# Altium project STM_System_Board.PrjPCB (part 6 of 6)
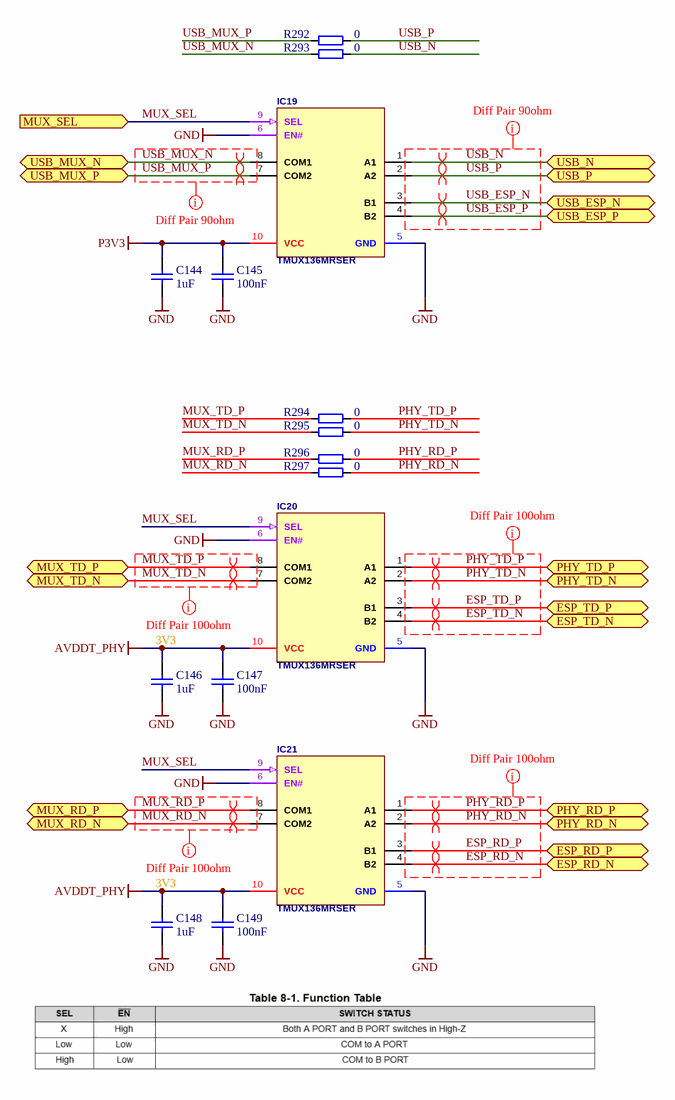
[diagram p14: USB_ETH_Mux.SchDoc]

## Nets that join several sheets
AVDDT_PHY: CPU (J16.35 J16.38 J16.41), Ethernet (12 pins), RMII (7 pins), USB_ETH_Mux (6 pins)
GND: STM_System_Board (20 pins), USB (11 pins), CPU (81 pins), Cpcis_connectors_P4_P5_P6 (80 pins), ST_SYS_Board_FPGA (D13.2 D14.2 IC6.AD4 IC6.AF4), U_LVDS_Driver2 (37 pins), U_LVDS_Driver1 (37 pins), U_LVDS_Driver4 (37 pins), U_LVDS_Driver6 (37 pins), U_LVDS_Driver5 (37 pins), U_LVDS_Driver3 (37 pins), STM_System_Board_Supply (53 pins), ST_SYS_Board_FPGA_SUP (255 pins), DIO_buffer (13 pins), Ethernet (11 pins), ST_SYS_Board_Config (14 pins), ST_SYS_Board_Clocking (11 pins), RMII (14 pins), USB_ETH_Mux (12 pins)
P1V1: STM_System_Board_Supply (11 pins), ST_SYS_Board_FPGA_SUP (45 pins)
P2V5: STM_System_Board_Supply (7 pins), ST_SYS_Board_FPGA_SUP (48 pins), ST_SYS_Board_Clocking (7 pins)
P3V3: STM_System_Board (D12.5 W1.1), CPU (52 pins), ST_SYS_Board_FPGA (D13.5 D14.5 IC6.AE4 R229.2), U_LVDS_Driver2 (35 pins), U_LVDS_Driver1 (35 pins), U_LVDS_Driver4 (35 pins), U_LVDS_Driver6 (35 pins), U_LVDS_Driver5 (35 pins), U_LVDS_Driver3 (35 pins), STM_System_Board_Supply (10 pins), ST_SYS_Board_FPGA_SUP (21 pins), DIO_buffer (9 pins), ST_SYS_Board_Config (13 pins), ST_SYS_Board_Clocking (OSC1.1 OSC1.4), RMII (8 pins), USB_ETH_Mux (C144.2 C145.1 IC19.10)
1_PE_CLK_N: Cpcis_connectors_P4_P5_P6 (J31.B5), ST_SYS_Board_Clocking (IC17.25)
1_PE_CLK_P: Cpcis_connectors_P4_P5_P6 (J31.A5), ST_SYS_Board_Clocking (IC17.24)
1_SERVMOD_N: CPU (IC9.12 J16.12), Cpcis_connectors_P4_P5_P6 (J31.C5)
2_PE_CLK_N: Cpcis_connectors_P4_P5_P6 (J31.E5), ST_SYS_Board_Clocking (IC17.21)
2_PE_CLK_P: Cpcis_connectors_P4_P5_P6 (J31.D5), ST_SYS_Board_Clocking (IC17.20)
2_SERVMOD_N: CPU (IC9.13 J16.13), Cpcis_connectors_P4_P5_P6 (J31.F5)
3_PE_CLK_N: Cpcis_connectors_P4_P5_P6 (J31.H5), ST_SYS_Board_Clocking (IC17.19)
3_PE_CLK_P: Cpcis_connectors_P4_P5_P6 (J31.G5), ST_SYS_Board_Clocking (IC17.18)
3_SERVMOD_N: CPU (IC9.14 J16.15), Cpcis_connectors_P4_P5_P6 (J31.I5)
4_PE_CLK_N: Cpcis_connectors_P4_P5_P6 (J31.K5), ST_SYS_Board_Clocking (IC17.17)
4_PE_CLK_P: Cpcis_connectors_P4_P5_P6 (J31.J5), ST_SYS_Board_Clocking (IC17.16)
4_SERVMOD_N: CPU (IC9.15 J16.16), Cpcis_connectors_P4_P5_P6 (J31.L5)
5_PE_CLK_N: Cpcis_connectors_P4_P5_P6 (J31.C6), ST_SYS_Board_Clocking (IC17.23)
5_PE_CLK_P: Cpcis_connectors_P4_P5_P6 (J31.B6), ST_SYS_Board_Clocking (IC17.22)
5_SERVMOD_N: CPU (IC9.50 J16.18), Cpcis_connectors_P4_P5_P6 (J31.A6)
6_PE_CLK_N: Cpcis_connectors_P4_P5_P6 (J31.F6), ST_SYS_Board_Clocking (IC17.27)
6_PE_CLK_P: Cpcis_connectors_P4_P5_P6 (J31.E6), ST_SYS_Board_Clocking (IC17.26)
6_SERVMOD_N: CPU (IC9.53 J16.19), Cpcis_connectors_P4_P5_P6 (J31.D6)
7_PE_CLK_N: Cpcis_connectors_P4_P5_P6 (J31.I6), ST_SYS_Board_Clocking (IC17.13)
7_PE_CLK_P: Cpcis_connectors_P4_P5_P6 (J31.H6), ST_SYS_Board_Clocking (IC17.12)
7_SERVMOD_N: CPU (IC9.54 J16.21), Cpcis_connectors_P4_P5_P6 (J31.G6)
8_PE_CLK_N: Cpcis_connectors_P4_P5_P6 (J31.L6), ST_SYS_Board_Clocking (IC17.3)
8_PE_CLK_P: Cpcis_connectors_P4_P5_P6 (J31.K6), ST_SYS_Board_Clocking (IC17.2)
8_SERVMOD_N: CPU (IC9.55 J16.22), Cpcis_connectors_P4_P5_P6 (J31.J6)
CFG_FLASH_MISO: CPU (J16.27 R185.1), ST_SYS_Board_Config (IC15.8)
CFG_FLASH_MOSI: CPU (J16.30 R197.1), ST_SYS_Board_Config (IC15.4)
CFG_FLASH_SCLK: CPU (J16.31 R177.1), ST_SYS_Board_Config (IC15.1)
CFG_FLASH_SSEL: CPU (J16.33 R179.1), ST_SYS_Board_Config (IC15.11)
CFG_FLASH_UP_EN: CPU (IC9.68 J16.28), ST_SYS_Board_Config (5 pins)
CFG_TCK: CPU (J17.8), ST_SYS_Board_Config (D11.1 IC6.AD5 J6.6 R239.2)
CFG_TDI: CPU (J17.11), ST_SYS_Board_Config (D11.4 IC6.AC5 J6.10 R241.1)
CFG_TDO: CPU (J17.10), ST_SYS_Board_Config (D11.6 IC6.AB5 J6.8 R227.1)
CFG_TMS: CPU (J17.7), ST_SYS_Board_Config (D11.3 IC6.AE5 J6.4 R240.2)
CLK_FPGA: ST_SYS_Board_FPGA (IC6.A24), ST_SYS_Board_Clocking (R205.2)
CLK_IN_SEL: CPU (IC9.132 J17.5), ST_SYS_Board_Clocking (R243.1)
CLK_STM: CPU (R176.1), ST_SYS_Board_FPGA (IC6.A2)
CPU_RESETn: CPU (R14.2 T4.3), STM_System_Board_Supply (IC13.26 R194.1 T1.1 TP8.1)
CS: STM_System_Board (P1.2), ST_SYS_Board_FPGA (D13.3 IC6.A23), U_LVDS_Driver2 (IC8B.12), U_LVDS_Driver1 (IC8A.12), U_LVDS_Driver4 (IC8D.12), U_LVDS_Driver6 (IC8F.12), U_LVDS_Driver5 (IC8E.12), U_LVDS_Driver3 (IC8C.12)
DIO_OEn0: ST_SYS_Board_FPGA (IC6.AC26), DIO_buffer (IC2.1 IC3.1 R11.2)
DIO_OEn1: ST_SYS_Board_FPGA (IC6.AB26), DIO_buffer (IC2.4 IC3.4 R18.2)
DIO_OEn2: ST_SYS_Board_FPGA (IC6.AB25), DIO_buffer (IC2.10 IC3.10 R21.2)
DIO_OEn3: ST_SYS_Board_FPGA (IC6.AA26), DIO_buffer (IC2.13 IC3.13 R59.2)
DONE: CPU (IC9.142 J16.24 R136.2), ST_SYS_Board_FPGA (IC6.AC4)
ESP_RD_N: CPU (J16.39), USB_ETH_Mux (IC21.4)
ESP_RD_P: CPU (J16.40), USB_ETH_Mux (IC21.3)
ESP_TD_N: CPU (J16.37), USB_ETH_Mux (IC20.4)
ESP_TD_P: CPU (J16.36), USB_ETH_Mux (IC20.3)
ETH_PHY_NRST: CPU (IC9.2), RMII (IC11.15 R198.2)
FP_LED_0: STM_System_Board (R58.2), CPU (IC9.37 J16.6)
FP_LED_1: STM_System_Board (R76.2), CPU (IC9.96 J16.7)
FP_LED_2: STM_System_Board (R77.2), CPU (IC9.97 J16.9)
FP_LED_3: STM_System_Board (R78.2), CPU (IC9.34 J16.10)
FSEN: STM_System_Board (P1.1), ST_SYS_Board_FPGA (D13.1 IC6.B19), U_LVDS_Driver2 (8 pins), U_LVDS_Driver1 (8 pins), U_LVDS_Driver4 (8 pins), U_LVDS_Driver6 (8 pins), U_LVDS_Driver5 (8 pins), U_LVDS_Driver3 (8 pins)
I2C1_SCL: CPU (5 pins), STM_System_Board_Supply (IC18.3)
I2C1_SDA: CPU (5 pins), STM_System_Board_Supply (IC18.4)
IO0: ST_SYS_Board_FPGA (IC6.AE26), DIO_buffer (R17.2)
IO1: ST_SYS_Board_FPGA (IC6.AE25), DIO_buffer (R5.2)
IO2: ST_SYS_Board_FPGA (IC6.AD25), DIO_buffer (R6.2)
IO3: ST_SYS_Board_FPGA (IC6.AD26), DIO_buffer (R7.2)
LED1: Ethernet (R39.1), RMII (IC11.2 R55.1)
LED2: Ethernet (R212.1), RMII (IC11.3)
MISO: STM_System_Board (P1.5), ST_SYS_Board_FPGA (D14.6 IC6.AD3), U_LVDS_Driver6 (IC8F.9)
MISO: U_LVDS_Driver2 (IC8B.14), U_LVDS_Driver1 (IC8A.9)
MISO: U_LVDS_Driver2 (IC8B.9), U_LVDS_Driver3 (IC8C.14)
MISO: U_LVDS_Driver4 (IC8D.14), U_LVDS_Driver3 (IC8C.9)
MISO: U_LVDS_Driver4 (IC8D.9), U_LVDS_Driver5 (IC8E.14)
MISO: U_LVDS_Driver6 (IC8F.14), U_LVDS_Driver5 (IC8E.9)
MLVDS_RxTx1_8: ST_SYS_Board_FPGA (IC6.E21), U_LVDS_Driver1 (R167A.1)
MLVDS_RxTx1_9: ST_SYS_Board_FPGA (IC6.D22), U_LVDS_Driver1 (R169A.1)
MLVDS_RxTx1_10: ST_SYS_Board_FPGA (IC6.C22), U_LVDS_Driver1 (R171A.1)
MLVDS_RxTx1_11: ST_SYS_Board_FPGA (IC6.C17), U_LVDS_Driver1 (R173A.1)
MLVDS_RxTx1_12: ST_SYS_Board_FPGA (IC6.B23), U_LVDS_Driver1 (R175A.1)
MLVDS_RxTx1_13: ST_SYS_Board_FPGA (IC6.C21), U_LVDS_Driver1 (R184A.1)
MLVDS_RxTx1_14: ST_SYS_Board_FPGA (IC6.C19), U_LVDS_Driver1 (R191A.1)
MLVDS_RxTx1_15: ST_SYS_Board_FPGA (IC6.C18), U_LVDS_Driver1 (R193A.1)
MLVDS_RxTx2_8: ST_SYS_Board_FPGA (IC6.A22), U_LVDS_Driver2 (R167B.1)
MLVDS_RxTx2_9: ST_SYS_Board_FPGA (IC6.A21), U_LVDS_Driver2 (R169B.1)
MLVDS_RxTx3_8: ST_SYS_Board_FPGA (IC6.D17), U_LVDS_Driver3 (R167C.1)
MLVDS_RxTx3_9: ST_SYS_Board_FPGA (IC6.A19), U_LVDS_Driver3 (R169C.1)
MLVDS_RxTx4_8: ST_SYS_Board_FPGA (IC6.A17), U_LVDS_Driver4 (R167D.1)
MLVDS_RxTx4_9: ST_SYS_Board_FPGA (IC6.B16), U_LVDS_Driver4 (R169D.1)
MLVDS_RxTx5_8: ST_SYS_Board_FPGA (IC6.A13), U_LVDS_Driver5 (R167E.1)
MLVDS_RxTx5_9: ST_SYS_Board_FPGA (IC6.D14), U_LVDS_Driver5 (R169E.1)
MLVDS_RxTx6_8: ST_SYS_Board_FPGA (IC6.C10), U_LVDS_Driver6 (R167F.1)
MLVDS_RxTx6_9: ST_SYS_Board_FPGA (IC6.A9), U_LVDS_Driver6 (R169F.1)
MLVDS_RxTx10: ST_SYS_Board_FPGA (IC6.A16), U_LVDS_Driver4 (R171D.1)
MLVDS_RxTx10: ST_SYS_Board_FPGA (IC6.A18), U_LVDS_Driver3 (R171C.1)
MLVDS_RxTx10: ST_SYS_Board_FPGA (IC6.D19), U_LVDS_Driver2 (R171B.1)
MLVDS_RxTx10: ST_SYS_Board_FPGA (IC6.A8), U_LVDS_Driver6 (R171F.1)
MLVDS_RxTx10: ST_SYS_Board_FPGA (IC6.A11), U_LVDS_Driver5 (R171E.1)
MLVDS_RxTx11: ST_SYS_Board_FPGA (IC6.B17), U_LVDS_Driver3 (R173C.1)
MLVDS_RxTx11: ST_SYS_Board_FPGA (IC6.B21), U_LVDS_Driver2 (R173B.1)
MLVDS_RxTx11: ST_SYS_Board_FPGA (IC6.C14), U_LVDS_Driver4 (R173D.1)
MLVDS_RxTx11: ST_SYS_Board_FPGA (IC6.B10), U_LVDS_Driver5 (R173E.1)
MLVDS_RxTx11: ST_SYS_Board_FPGA (IC6.C6), U_LVDS_Driver6 (R173F.1)
MLVDS_RxTx12: ST_SYS_Board_FPGA (IC6.C16), U_LVDS_Driver2 (R175B.1)
MLVDS_RxTx12: ST_SYS_Board_FPGA (IC6.B8), U_LVDS_Driver6 (R175F.1)
MLVDS_RxTx12: ST_SYS_Board_FPGA (IC6.C8), U_LVDS_Driver4 (R175D.1)
MLVDS_RxTx12: ST_SYS_Board_FPGA (IC6.D10), U_LVDS_Driver3 (R175C.1)
MLVDS_RxTx12: ST_SYS_Board_FPGA (IC6.E6), U_LVDS_Driver5 (R175E.1)
MLVDS_RxTx13: ST_SYS_Board_FPGA (IC6.A15), U_LVDS_Driver2 (R184B.1)
MLVDS_RxTx13: ST_SYS_Board_FPGA (IC6.A5), U_LVDS_Driver4 (R184D.1)
MLVDS_RxTx13: ST_SYS_Board_FPGA (IC6.A6), U_LVDS_Driver6 (R184F.1)
MLVDS_RxTx13: ST_SYS_Board_FPGA (IC6.C11), U_LVDS_Driver3 (R184C.1)
MLVDS_RxTx13: ST_SYS_Board_FPGA (IC6.D5), U_LVDS_Driver5 (R184E.1)
MLVDS_RxTx14: ST_SYS_Board_FPGA (IC6.A14), U_LVDS_Driver2 (R191B.1)
MLVDS_RxTx14: ST_SYS_Board_FPGA (IC6.B13), U_LVDS_Driver5 (R191E.1)
MLVDS_RxTx14: ST_SYS_Board_FPGA (IC6.A4), U_LVDS_Driver6 (R191F.1)
MLVDS_RxTx14: ST_SYS_Board_FPGA (IC6.B6), U_LVDS_Driver3 (R191C.1)
MLVDS_RxTx14: ST_SYS_Board_FPGA (IC6.C5), U_LVDS_Driver4 (R191D.1)
MLVDS_RxTx15: ST_SYS_Board_FPGA (IC6.B14), U_LVDS_Driver2 (R193B.1)
MLVDS_RxTx15: ST_SYS_Board_FPGA (IC6.A10), U_LVDS_Driver5 (R193E.1)
MLVDS_RxTx15: ST_SYS_Board_FPGA (IC6.B4), U_LVDS_Driver6 (R193F.1)
MLVDS_RxTx15: ST_SYS_Board_FPGA (IC6.C9), U_LVDS_Driver3 (R193C.1)
MLVDS_RxTx15: ST_SYS_Board_FPGA (IC6.D6), U_LVDS_Driver4 (R193D.1)
MOSI: STM_System_Board (P1.4), ST_SYS_Board_FPGA (D14.4 IC6.AB3), U_LVDS_Driver1 (IC8A.14)
MUX_RD_N: Ethernet (D3.1 R40.2 R222.1), USB_ETH_Mux (IC21.7 R297.1)
MUX_RD_P: Ethernet (D3.3 R41.2 R221.1), USB_ETH_Mux (IC21.8 R296.1)
MUX_SEL: CPU (J16.1 R291.2 T4.1), USB_ETH_Mux (IC19.9 IC20.9 IC21.9)
MUX_TD_N: Ethernet (D3.4 R37.1 R220.1), USB_ETH_Mux (IC20.7 R295.1)
MUX_TD_P: Ethernet (D3.6 R36.1 R199.1), USB_ETH_Mux (IC20.8 R294.1)
NetC129_1: STM_System_Board (J10.1), ST_SYS_Board_Clocking (C129.1 D16.6)
NetD10_1: STM_System_Board (J1.1), DIO_buffer (D10.1 R15.1 R19.2 R20.1)
NetD10_3: STM_System_Board (J2.1), DIO_buffer (D10.3 R8.1 R9.2 R10.1)
NetD10_4: STM_System_Board (J4.1), DIO_buffer (D10.4 R92.1 R93.2 R200.1)
NetD10_6: STM_System_Board (J5.1), DIO_buffer (D10.6 R201.1 R202.2 R203.1)
NetIC9_27: CPU (IC9.27), RMII (IC11.13)
NetIC9_35: CPU (IC9.35), RMII (R60.1)
NetIC9_36: CPU (IC9.36), RMII (IC11.12 R98.2)
NetIC9_43: CPU (IC9.43), RMII (R50.1)
NetIC9_44: CPU (IC9.44), RMII (R45.1)
NetIC9_45: CPU (IC9.45), RMII (R46.1)
NetIC9_70: CPU (IC9.70), RMII (IC11.16)
NetIC9_74: CPU (IC9.74), RMII (IC11.18)
NetIC9_128: CPU (IC9.128), RMII (IC11.17)
PHY_RD_N: RMII (IC11.22), USB_ETH_Mux (IC21.2 R297.2)
PHY_RD_P: RMII (IC11.23), USB_ETH_Mux (IC21.1 R296.2)
PHY_TD_N: RMII (IC11.20), USB_ETH_Mux (IC20.2 R295.2)
PHY_TD_P: RMII (IC11.21), USB_ETH_Mux (IC20.1 R294.2)
PROGRAM_N: CPU (IC9.141 J16.25), ST_SYS_Board_FPGA (IC6.AB4)
QSPI_CFG_CEN: ST_SYS_Board_FPGA (IC6.AA2), ST_SYS_Board_Config (IC14.1 IC15.10 R223.1)
QSPI_CFG_IO2: ST_SYS_Board_FPGA (IC6.AF2), ST_SYS_Board_Config (IC14.3 R225.1)
QSPI_CFG_IO3: ST_SYS_Board_FPGA (IC6.AE1), ST_SYS_Board_Config (IC14.7 R224.1)
QSPI_CFG_MISO_IO1: ST_SYS_Board_FPGA (IC6.AD2), ST_SYS_Board_Config (IC14.2 IC15.9)
QSPI_CFG_MOSI_IO0: ST_SYS_Board_FPGA (IC6.AE2), ST_SYS_Board_Config (IC14.5 IC15.3)
QSPI_CFG_SCK: ST_SYS_Board_FPGA (IC6.AE3), ST_SYS_Board_Config (IC14.6 IC15.2 R226.1)
QSPI_CLK: CPU (R128.1), ST_SYS_Board_FPGA (IC6.E11)
QSPI_IO0: CPU (R186.2), ST_SYS_Board_FPGA (IC6.AB24)
QSPI_IO1: CPU (R187.2), ST_SYS_Board_FPGA (IC6.AA24)
QSPI_IO2: CPU (R188.2), ST_SYS_Board_FPGA (IC6.AA23)
QSPI_IO3: CPU (R189.2), ST_SYS_Board_FPGA (IC6.AA22)
QSPI_NCS: CPU (IC9.112), ST_SYS_Board_FPGA (IC6.AF25)
SCK: STM_System_Board (P1.3), ST_SYS_Board_FPGA (D13.4 IC6.A25), U_LVDS_Driver2 (IC8B.11), U_LVDS_Driver1 (IC8A.11), U_LVDS_Driver4 (IC8D.11), U_LVDS_Driver6 (IC8F.11), U_LVDS_Driver5 (IC8E.11), U_LVDS_Driver3 (IC8C.11)
SPI1_MISO: CPU (IC9.124 J17.14 R185.2), ST_SYS_Board_FPGA (IC6.E16)
SPI1_MOSI: CPU (IC9.123 J17.13 R197.2), ST_SYS_Board_FPGA (IC6.E19)
SPI1_NSS: CPU (IC9.125 J17.16 R179.2), ST_SYS_Board_FPGA (IC6.D21)
SPI1_SCK: CPU (IC9.126 J17.17 R177.2), ST_SYS_Board_FPGA (IC6.C13)
SPI2_MISO: CPU (IC9.28 J17.20), ST_SYS_Board_FPGA (IC6.AC1)
SPI2_MOSI: CPU (IC9.29 J17.19), ST_SYS_Board_FPGA (IC6.AB2)
SPI2_NSS: CPU (IC9.73 J17.22), ST_SYS_Board_FPGA (IC6.D9)
SPI2_SCK: CPU (IC9.117 J17.23), ST_SYS_Board_FPGA (IC6.D13)
SPI3_MISO: CPU (IC9.134 J17.26), ST_SYS_Board_FPGA (IC6.D16)
SPI3_MOSI: CPU (IC9.48 J17.25), ST_SYS_Board_FPGA (IC6.AA1)
SPI3_NSS: CPU (IC9.40 J17.28), ST_SYS_Board_FPGA (IC6.AB1)
SPI3_SCK: CPU (IC9.111 J17.29), ST_SYS_Board_FPGA (IC6.E13)
SPI4_CLK: CPU (IC9.1 J17.35), ST_SYS_Board_FPGA (IC6.B11)
SPI4_MISO: CPU (IC9.4 J17.32), ST_SYS_Board_FPGA (IC6.D11)
SPI4_MOSI: CPU (IC9.5 J17.31), ST_SYS_Board_FPGA (IC6.E10)
SPI4_NSS: CPU (IC9.3 J17.34), ST_SYS_Board_FPGA (IC6.E8)
SPI5_MISO: CPU (IC9.20 J17.38), ST_SYS_Board_FPGA (IC6.AD1)
SPI5_MOSI: CPU (IC9.21 J17.37), ST_SYS_Board_FPGA (IC6.AC2)
SPI5_NSS: CPU (IC9.18 J17.40), ST_SYS_Board_FPGA (IC6.D8)
SPI5_SCK: CPU (IC9.19 J17.41), ST_SYS_Board_FPGA (IC6.A3)
SPI6_MISO: CPU (IC9.127 J17.44), ST_SYS_Board_FPGA (IC6.D18)
SPI6_MOSI: CPU (IC9.129 J17.43), ST_SYS_Board_FPGA (IC6.E17)
SPI6_NSS: CPU (IC9.93 J17.46), ST_SYS_Board_FPGA (IC6.E14)
SPI6_SCK: CPU (IC9.41 J17.47), ST_SYS_Board_FPGA (IC6.A12)
USART3_RX: STM_System_Board (D12.6 W1.2), CPU (IC9.78)
USART3_TX: STM_System_Board (D12.4 W1.3), CPU (IC9.77)
USB_ESP_N: CPU (J16.46), USB_ETH_Mux (IC19.3)
USB_ESP_P: CPU (J16.47), USB_ETH_Mux (IC19.4)
USB_ID: USB (C108.2 D22.1 FB2.1), CPU (IC9.102 J16.43)
USB_MUX_N: USB (D22.4 L9.2), USB_ETH_Mux (IC19.8 R293.1)
USB_MUX_P: USB (D22.3 L9.3), USB_ETH_Mux (IC19.7 R292.1)
USB_N: CPU (IC9.103), USB_ETH_Mux (IC19.1 R293.2)
USB_P: CPU (IC9.104), USB_ETH_Mux (IC19.2 R292.2)
VBUS_DET: USB (R73.1 R75.2), CPU (IC9.101 J16.44)

## Assembly variants
Basic: not fitted C2 C3 C4 C7 C10 C11 IC7A IC7B IC7C IC7D IC7E IC7F IC8A IC8B IC8C IC8D IC8E IC8F IC12A IC12B IC12C IC12D IC12E IC12F IC17 J10 R194 R283 R292 R293 R294 R295 R296 R297
Extended_with_Clocking: not fitted C2 C3 C4 C7 C10 C11 R194 R292 R293 R294 R295 R296 R297